# EAGLE design tinyDuinoCircuit (EAGLE 8.3.2)
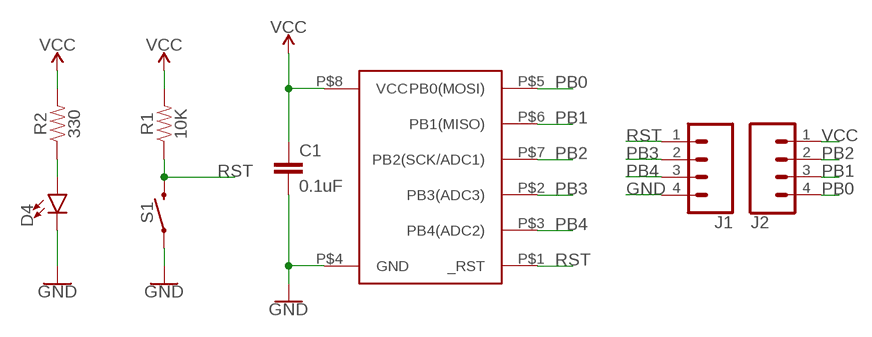
[diagram p0: schematic, sheet 1]

## Parts
C1  0.1uF  0.1UF-KIT-EZ-50V-20%  [CAP-PTH-SMALL-KIT]
D4  LED-3MM-NO_SILK  [LED_3MM-NS]
J1  CONN_04  [1X04]
J2  CONN_04  [1X04]
R1  10K  1KOHM-VERT-1/4W-5%  [AXIAL-0.1]
R2  330  1KOHM-VERT-1/4W-5%  [AXIAL-0.1]
S1  MOMENTARY-SWITCH-SPST-PTH-6.0MM  [TACTILE_SWITCH_PTH_6.0MM]
U$1  ATTINY85-DIP8  [DIP8]

## Nets
GND: C1.2 D4.K(C) J1.4 S1.1 U$1.P$4(GND)
N$1: D4.A R2.P$1
PB0: J2.4 U$1.P$5(PB0(MOSI))
PB1: J2.3 U$1.P$6(PB1(MISO))
PB2: J2.2 U$1.P$7(PB2(SCK/ADC1))
PB3: J1.2 U$1.P$2(PB3(ADC3))
PB4: J1.3 U$1.P$3(PB4(ADC2))
RST: J1.1 R1.P$1 S1.3 U$1.P$1(_RST)
VCC: C1.1 J2.1 R1.P$2 R2.P$2 U$1.P$8(VCC)

## Library data of the parts
C1 = SparkFun-Capacitors:0.1UF: 0.1µF ceramic capacitors A capacitor is a passive two-terminal electrical component used to store electrical energy temporarily in an electric field.; PROD_ID: CAP-08370
D4 = SparkFun-LED:LED: LED (Generic) Standard schematic elements and footprints for 5mm, 3mm, 1206, and 0603 sized LEDs. Generic LEDs with no color specified.
J1 J2 = SparkFun-Connectors:CONN_04: Multi connection point. Often used as Generic Header-pin footprint for 0.1 inch spaced/style header connections On any of the 0.1 inch spaced packages, you can populate with these: Break Away Headers - Straight <https://www.sparkfun.com/products/116> (PRT-00116) Break Away Male Headers - Right Angle <https://www.sparkfun.com/products/553> (PRT-00553) Female Headers <https://www.sparkfun.com/products/115> (PRT-00115) Break Away Headers - Machine Pin <https://www.sparkfun.com/products/117> (PRT-00117) Break Away Female Headers - Swiss Machine Pin <https://www.sparkfun.com/products/743> (PRT-00743) For SCREWTERMINALS and SPRING TERMINALS visit here: Screw Terimnals on SparkFun.com <https://www.sparkfun.com/search/results?term=Screw+Terminals> (5mm/3.5mm/2.54mm spacing) This device is also useful as a general connection point to wire up your design to another part of your project. Our various solder wires solder well into these plated through hole pads. Hook-Up Wire - Assortment (Stranded, 22 AWG) <https://www.sparkfun.com/products/11375> (PRT-11375) Hook-Up Wire - Assortment (Solid Core, 22 AWG) <https://www.sparkfun.com/products/11367> (PRT-11367) View the entire wire category on our website here <https://www.sparkfun.com/categories/141> Special notes: Molex polarized connector foot print use with SKU : PRT-08231 with associated crimp pins and housings. 1MM SMD Version SKU: PRT-10208; PROD_ID: CONN-09696
R1 R2 = SparkFun-Resistors:1KOHM: 1kΩ resistor A resistor is a passive two-terminal electrical component that implements electrical resistance as a circuit element. Resistors act to reduce current flow, and, at the same time, act to lower voltage levels within circuits. - Wikipedia; PROD_ID: RES-08380; VALUE: 1k
S1 = SparkFun-Switches:MOMENTARY-SWITCH-SPST: Momentary Switch (Pushbutton) - SPST Normally-open (NO) SPST momentary switches (buttons, pushbuttons). Variants PTH-12MM - 12mm square, through-hole Momentary Pushbutton Switch - 12mm Square <https://www.sparkfun.com/products/9190> (COM-09190) PTH-6.0MM, PTH-6.0MM-KIT - 6.0mm square, through-hole Mini Pushbutton Switch <https://www.sparkfun.com/products/97> (COM-00097) KIT package intended for soldering kit's - only one side of pads' copper is exposed. PTH-RIGHT-ANGLE-KIT - Right-angle, through-hole Right Angle Tactile Button <https://www.sparkfun.com/products/10791> - Used on SparkFun BigTime Watch Kit <https://www.sparkfun.com/products/11734> SMD-12MM - 12mm square, surface-mount Tactile Button - SMD (12mm) <https://www.sparkfun.com/products/12993> (COM-12993) Used on SparkFun PicoBoard <https://www.sparkfun.com/products/11888> SMD-4.5MM - 4.5mm Square Trackball Switch Used on SparkFun Blackberry Trackballer Breakout <https://www.sparkfun.com/products/13169> SMD-4.6MMX2.8MM - 4.60mm x 2.80mm, surface mount Used on SparkFun SAMD21 Mini Breakout <https://www.sparkfun.com/products/13664> SMD-5.2MM, SMD-5.2-REDUNDANT - 5.2mm square, surface-mount Mini Pushbutton Switch - SMD <https://www.sparkfun.com/products/8720> (COM-08720) Used on Arduino Pro Mini <https://www.sparkfun.com/products/11114> REDUNDANT package connects both switch circuits together SMD-6.0X3.5MM - 6.0 x 3.5mm, surface mount Momentary Reset Switch SMD <https://www.sparkfun.com/products/8229> (COM-08229) SMD-6.2MM-TALL - 6.2mm square, surface mount Tactile Button - SMD (6mm) <https://www.sparkfun.com/products/12992> Used on SparkFun Digital Sandbox <https://www.sparkfun.com/products/12651> SMD-RIGHT-ANGLE - Right-angle, surface mount Used on SparkFun Block for Intel® Edison - Arduino <https://www.sparkfun.com/products/13036>; PROD_ID: SWCH-08441; SF_SKU: COM-00097
U$1 = dip8pkg:ATTINY85-DIP8

## Board
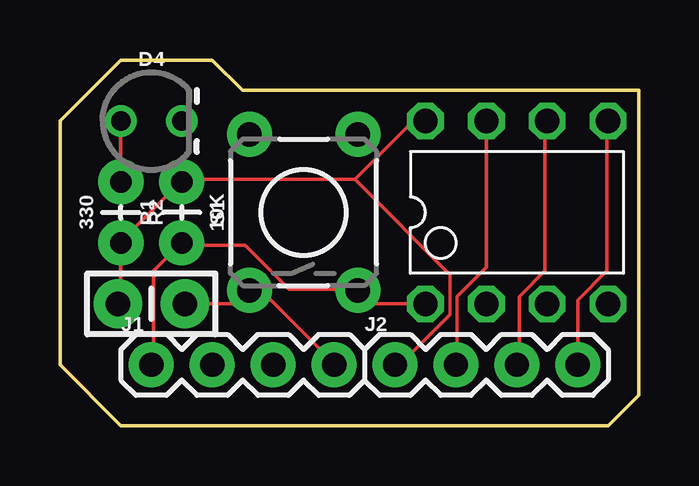
[diagram p1: board, top side]
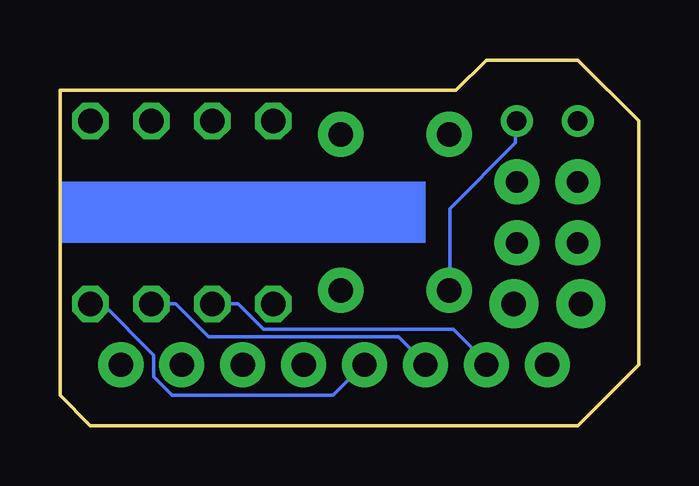
[diagram p2: board, bottom side, seen from below]

Size 24.13 x 15.24 mm. Coordinates in mm from the lower left corner, seen from the top.
Outline: 2.54,0 0,2.54 0,12.7 2.54,15.24 6.35,15.24 7.62,13.97 24.13,13.97 24.13,1.27 22.86,0 2.54,0
Copper layers (1*16): Top 0.035mm / dielectric 1.5mm / Bottom 0.035mm
Design rules "default": minimum track width 6mil, minimum drill 0.35mm, track to track 6mil, track to pad 6mil, pad to pad 6mil, via to via 6mil, smd to smd 6mil, copper to edge 40mil, drill to drill 6mil, minimum pad ring 10mil, minimum via ring 8mil, stop-mask expansion 4mil, vias tented up to drill 0mil, thermal gap 10mil

### Footprints (pad centres in the part's own frame; a part is rotated, then mirrored left to right if it is on the bottom)
CAP-PTH-SMALL-KIT = drill 1.016 pad 2.032: 1 -1.397,0; 2 1.397,0
LED_3MM-NS = drill 0.813: A -1.27,0; K 1.27,0
1X04 = drill 1.016 pad 1.88: 1 0,0; 2 2.54,0; 3 5.08,0; 4 7.62,0
AXIAL-0.1 = drill 0.9 pad 1.88: P$1 -1.27,0; P$2 1.27,0
TACTILE_SWITCH_PTH_6.0MM = drill 1.016 pad 1.88: 1 -3.251,2.261; 2 3.251,2.261; 3 -3.251,-2.261; 4 3.251,-2.261
DIP8 = drill 1.016 octagon: P$1 -3.81,3.81; P$2 -3.81,1.27; P$3 -3.81,-1.27; P$4 -3.81,-3.81; P$5 3.81,-3.81; P$6 3.81,-1.27; P$7 3.81,1.27; P$8 3.81,3.81

### Placement (x,y rotation side)
C1  3.81,5.08 0 top
D4  3.81,12.7 0 top
J1  3.81,2.54 0 top
J2  13.97,2.54 0 top
R1  5.08,8.89 90 top
R2  2.54,8.89 270 top
S1  10.16,8.89 90 top
U$1  19.05,8.89 90 top

### Tracks (layer width: path | path; a pad name or v marks a point on that pad's centre or on a via)
GND
  Top 0.152: C1.2 7.42,5.08 7.87,5.54 S1.1 8.03,5.54 8.48,5.54 11.38,2.64 J1.4
  Bottom 0.152: D4.K 5.13,12.7 5.13,11.79 7.87,9.04 7.87,5.69 S1.1 | U$1.P$4 22.35,5.08 20.22,2.95 20.22,2.03 19.46,1.27 12.75,1.27 11.53,2.49 J1.4
N$1
  Top 0.152: R2.P$1 D4.A
PB0
  Top 0.152: J2.4 21.59,5.23 22.81,6.45 22.81,12.7 U$1.P$5
PB1
  Top 0.152: U$1.P$6 20.22,12.7 20.22,6.45 19.15,5.38 19.15,2.64 J2.3
PB2
  Top 0.152: U$1.P$7 17.78,6.6 16.56,5.38 16.56,2.64 J2.2
PB3
  Bottom 0.152: U$1.P$2 16.71,5.08 15.65,4.01 7.72,4.01 6.35,2.64 J1.2
PB4
  Bottom 0.152: U$1.P$3 19.3,5.08 17.93,3.71 10.01,3.71 8.94,2.64 J1.3
RST
  Top 0.152: U$1.P$1 12.9,5.08 12.45,5.54 S1.3 12.29,5.69 9.55,5.69 7.72,7.52 5.13,7.52 R1.P$1 3.91,6.45 3.91,2.64 J1.1
VCC
  Top 0.152: C1.1 2.54,5.08 R2.P$2 2.54,7.67 4.98,10.11 R1.P$2 5.13,10.26 12.29,10.26 | U$1.P$8 14.73,12.7 12.29,10.26 | 12.29,10.26 16.26,6.3 16.26,4.62 14.28,2.64 13.97,2.64 J2.1
(copper drawn outside any net)
  shapes: Bottom area x1

### Text on the board
bStop: ~little bits~